# Altium schematic sheet Sheet1.SchDoc
size A4
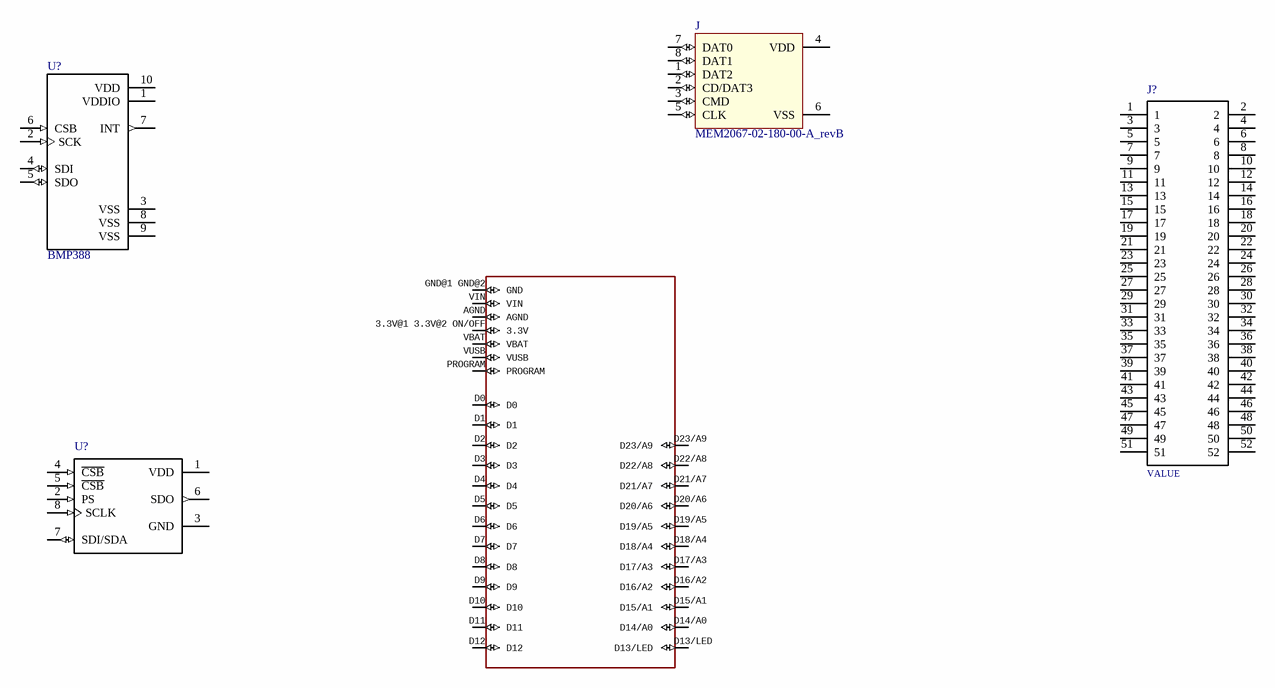
[diagram p0: Sheet1.SchDoc]

## Parts
(Parts that share a designator on the sheet are numbered #1, #2 ... from top to bottom, then left to right.)
?  TEENSY4.0  [TEENSY4.0]  (value not drawn)
J  MEM2067-02-180-00-A_revB  [MEM2067-02-180-00-A_revB]
J?  ESQ-126-39-G-D  [*HDRV52W64P254_26X2_6654X495H1359]  (value not drawn)
U?#1  BMP388  [*PQFN50P200X200X80-10N]
U?#2  MS561101BA03-50  [*SON125P500X300X100-8N]  (value not drawn)

## Nets

Not connected (* = marked no-connect by the designer): ? 3.3V@1 3.3V@2 ON/OFF(3.3V) AGND D0 D1 D2 D3 D4 D5 D6 D7 D8 D9 D10 D11 D12 D13/LED D14/A0 D15/A1 D16/A2 D17/A3 D18/A4 D19/A5 D20/A6 D21/A7 D22/A8 D23/A9 GND@1 GND@2(GND) PROGRAM VBAT VIN VUSB; J 1(DAT2) 2(CD/DAT3) 3(CMD) 4(VDD) 5(CLK) 6(VSS) 7(DAT0) 8(DAT1); J? 1 2 3 4 5 6 7 8 9 10 11 12 13 14 15 16 17 18 19 20 21 22 23 24 25 26 27 28 29 30 31 32 33 34 35 36 37 38 39 40 41 42 43 44 45 46 47 48 49 50 51 52; U?#1 1(VDDIO) 2(SCK) 3(VSS) 4(SDI) 5(SDO) 6(CSB) 7(INT) 8(VSS) 9(VSS) 10(VDD); U?#2 1(VDD) 2(PS) 3(GND) 4(~{CSB}) 5(~{CSB}) 6(SDO) 7(SDI/SDA) 8(SCLK)

## Notes on the sheet
- Title
- Size:
- Date:
- A4
- Author
- Time:
- Sheet
- Revision:
- of
- RIT Space Exploration Team
- Rochester Institute of Technology
- 1 Lomb Memorial Drive
- Rochester, NY 14623
- https://spex.rit.edu
- File:
- (in symbol ESQ-126-39-G-D) VALUE

## Library data of the parts
? = TEENSY4.0: GateName_1: G$1; SymbolName_1: TEENSY4.0; LibraryName: Teensy4.0; DeviceSetName: TEENSY4.0; Package: TEENSY4.0
J = MEM2067-02-180-00-A_revB: Micro SD Memory Card ConnectorSMT, Hinged, 1.80mm Profile
J? = ESQ-126-39-G-D: 52 Position Elevated Socket Connector Through Hole; MF: Samtec; Digi-Key_Part_Number: SAM10462-ND; Package: None; Digi-Key_Purchase_URL: https://www.digikey.com/product-detail/en/samtec-inc/ESQ-126-39-G-D/SAM10462-ND/3601055?utm_source=snapeda&utm_medium=aggregator&utm_campaign=symbol; SnapEDA_Link: https://www.snapeda.com/parts/ESQ-126-39-G-D/Samtec%20Inc./view-part/490181/?ref=snap; MP: ESQ-126-39-G-D; Value: *
U?#1 = BMP388: Pressure Sensor 4.35PSI ~ 18.13PSI _30kPa ~ 125kPa_ Absolute 10-WFLGA; MF: Bosch Sensortec; Digi-Key_Part_Number: 828-1079-1-ND; SnapEDA_Link: https://www.snapeda.com/parts/BMP388/Bosch%20Sensortec/view-part/2747857/?ref=snap; Package: WFLGA-10 Bosch Tools; Digi-Key_Purchase_URL: https://www.digikey.com/product-detail/en/bosch-sensortec/BMP388/828-1079-1-ND/8322640?utm_source=snapeda&utm_medium=aggregator&utm_campaign=symbol; MP: BMP388; Value: *
U?#2 = MS561101BA03-50: Pressure Sensor 1.44V to 3.6V 0.01bar to 1.2bar Absolute 8-Pin QFN T/R; MF: TE Connectivity; SnapEDA_Link: https://www.snapeda.com/parts/MS561101BA03-50/TE%20Connectivity%20ALCOSWITCH%20Switches/view-part/213247/?ref=snap; Digi-Key_Part_Number: 223-1622-1-ND; EU_RoHS_Compliance: Compliant; TE_purchase_URL: https://www.te.com/usa-en/product-MS561101BA03-50.html?te_bu=Cor&te_type=disp&te_campaign=seda_glo_cor-seda-global-disp-prtnr-fy19-seda-model-bom-cta_sma-317_1&elqCampaignId=32493; Package: SMD-8 TE Connectivity; MP: MS561101BA03-50; Digi-Key_Purchase_URL: https://www.digikey.com/product-detail/en/te-connectivity-measurement-specialties/MS561101BA03-50/223-1622-1-ND/5277638?utm_source=snapeda&utm_medium=aggregator&utm_campaign=symbol; Value: *